# Altium schematic sheet Core.SchDoc
size A4
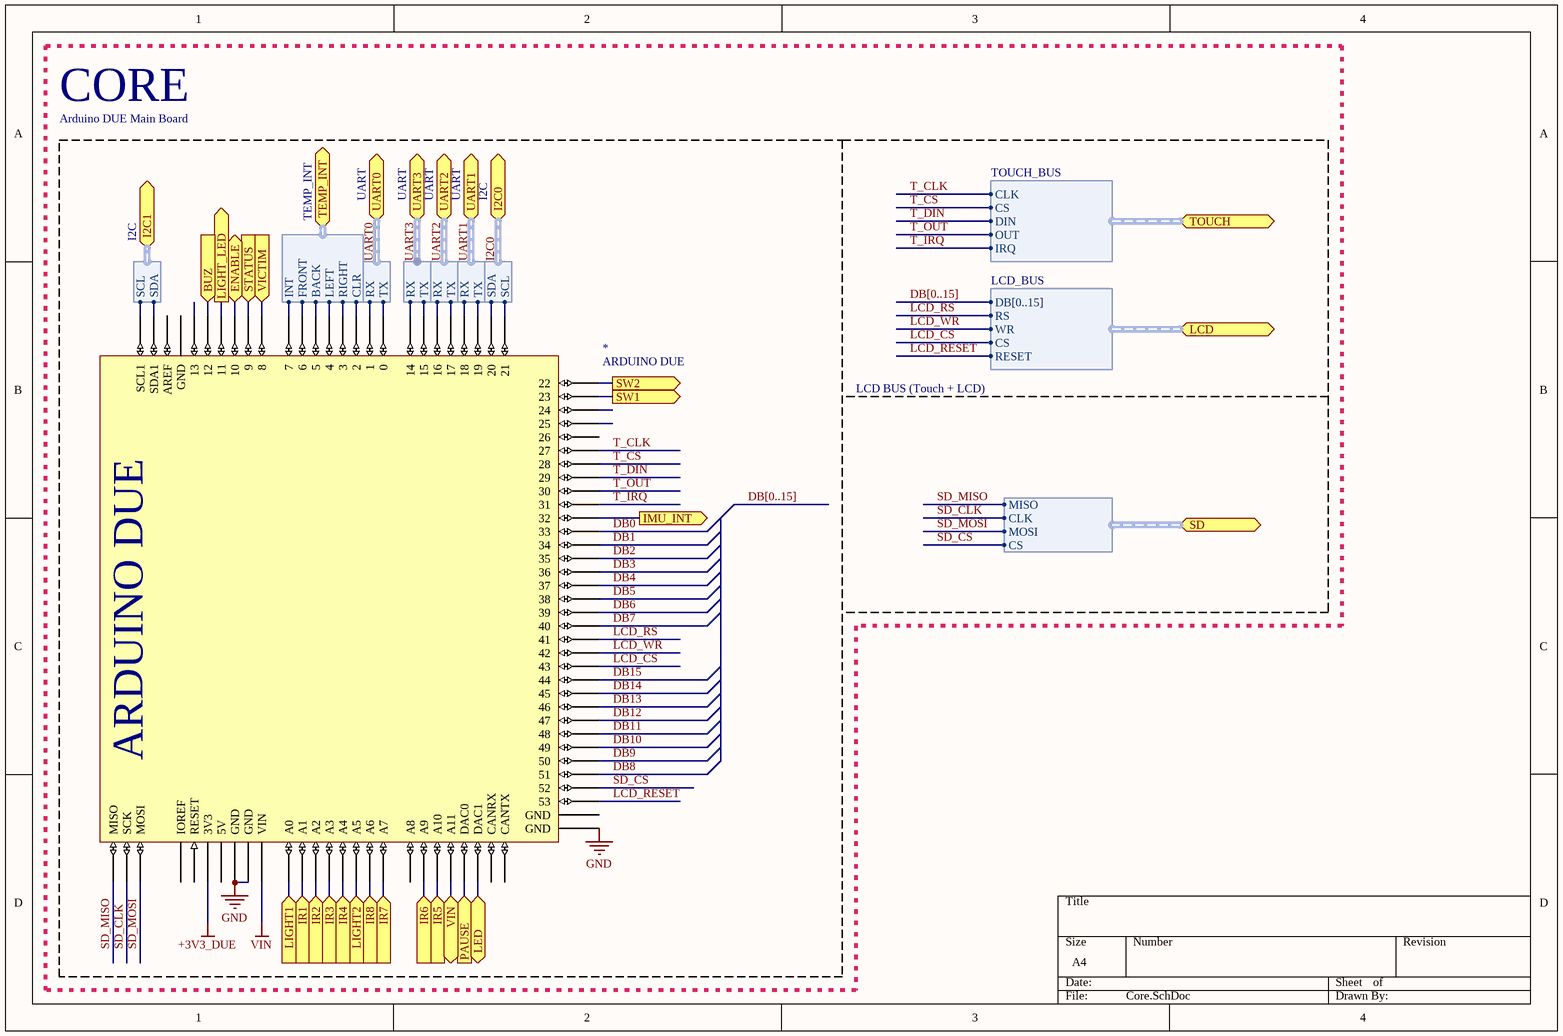
[diagram p0: Core.SchDoc]

## Parts
*  ARDUINO DUE  [ARDUINO-DUE]

## Blocks framed on the sheet
Arduino DUE Main Board: *

## Ports
BUZ (in), ENABLE, I2C0 (harness I2C), I2C1 (harness I2C), IMU_INT (out), IR1 (in), IR2 (in), IR3 (in), IR4 (in), IR5 (in), IR6 (in), IR7 (in), IR8 (in), LCD (harness LCD_BUS), LED, LIGHT1 (in), LIGHT2 (in), LIGHT_LED (out), PAUSE (in), SD (harness SD), STATUS (in), SW1 (out), SW2 (out), TEMP_INT (harness TEMP_INT), TOUCH (harness TOUCH_BUS), UART0 (harness UART), UART1 (harness UART), UART2 (harness UART), UART3 (harness UART), VICTIM (in), VIN

## Harnesses
LCD_BUS: CS, DB[0..15], RESET, RS, WR
TOUCH_BUS: CLK, CS, DIN, OUT, IRQ
UART: RX, TX
I2C: SDA, SCL
TEMP_INT: INT, FRONT, BACK, LEFT, RIGHT, CLR
SD: MISO, MOSI, CLK, CS

## Nets
+3V3_DUE: *.3V3
GND: *.GND2(GND) *.GND3(GND) *.GND5(GND)
VIN: *.VIN
BUZ: *.12 ; port BUZ
DB0: *.33
DB1: *.34
DB2: *.35
DB3: *.36
DB4: *.37
DB5: *.38
DB6: *.39
DB7: *.40
DB8: *.51
DB9: *.50
DB10: *.49
DB11: *.48
DB12: *.47
DB13: *.46
DB14: *.45
DB15: *.44
ENABLE: *.10 ; port ENABLE
I2C0.SCL: *.21 ; port I2C0.SCL
I2C0.SDA: *.20 ; port I2C0.SDA
IMU_INT: *.32 ; port IMU_INT
IR1: *.A1 ; port IR1
IR2: *.A2 ; port IR2
IR3: *.A3 ; port IR3
IR4: *.A4 ; port IR4
IR5: *.A10 ; port IR5
IR6: *.A9 ; port IR6
IR7: *.A7 ; port IR7
IR8: *.A6 ; port IR8
LCD_CS: *.43 ; port LCD.CS
LCD_RESET: *.53 ; port LCD.RESET
LCD_RS: *.41 ; port LCD.RS
LCD_WR: *.42 ; port LCD.WR
LED: *.DAC1 ; port LED
LIGHT1: *.A0 ; port LIGHT1
LIGHT2: *.A5 ; port LIGHT2
LIGHT_LED: *.11 ; port LIGHT_LED
PAUSE: *.DAC0 ; port PAUSE
SD_CLK: *.SCK ; port SD.CLK
SD_CS: *.52 ; port SD.CS
SD_MISO: *.MISO ; port SD.MISO
SD_MOSI: *.MOSI ; port SD.MOSI
STATUS: *.9 ; port STATUS
SW1: *.23 ; port SW1
SW2: *.22 ; port SW2
T_CLK: *.27 ; port TOUCH.CLK
T_CS: *.28 ; port TOUCH.CS
T_DIN: *.29 ; port TOUCH.DIN
T_IRQ: *.31 ; port TOUCH.IRQ
T_OUT: *.30 ; port TOUCH.OUT
UART0.RX: *.1 ; port UART0.RX
UART0.TX: *.0 ; port UART0.TX
UART1.RX: *.18 ; port UART1.RX
UART1.TX: *.19 ; port UART1.TX
UART2.RX: *.16 ; port UART2.RX
UART2.TX: *.17 ; port UART2.TX
UART3.RX: *.14 ; port UART3.RX
UART3.TX: *.15 ; port UART3.TX
VICTIM: *.8 ; port VICTIM
VIN: *.A11 ; port VIN  [a separate net that carries the same name]
Net*_2: *.2 ; port TEMP_INT.CLR
Net*_3: *.3 ; port TEMP_INT.RIGHT
Net*_4: *.4 ; port TEMP_INT.LEFT
Net*_5: *.5 ; port TEMP_INT.BACK
Net*_6: *.6 ; port TEMP_INT.FRONT
Net*_7: *.7 ; port TEMP_INT.INT
Net*_SCL1: *.SCL1 ; port I2C1.SCL
Net*_SDA1: *.SDA1 ; port I2C1.SDA

Not connected (* = marked no-connect by the designer): * 5V 13 24 25 26 A8 AREF CANRX CANTX GND1(GND) GND4(GND) IOREF RESET

## Buses and harness runs
bus DB[0..15]
harness I2C0 = port I2C0
harness UART0 = port UART0
harness UART1 = port UART1
harness UART2 = port UART2
harness UART3 = port UART3

## Notes on the sheet
- CORE
- LCD BUS (Touch + LCD)